# Altium schematic sheet 14-Counter74LS192.SchDoc
size A4
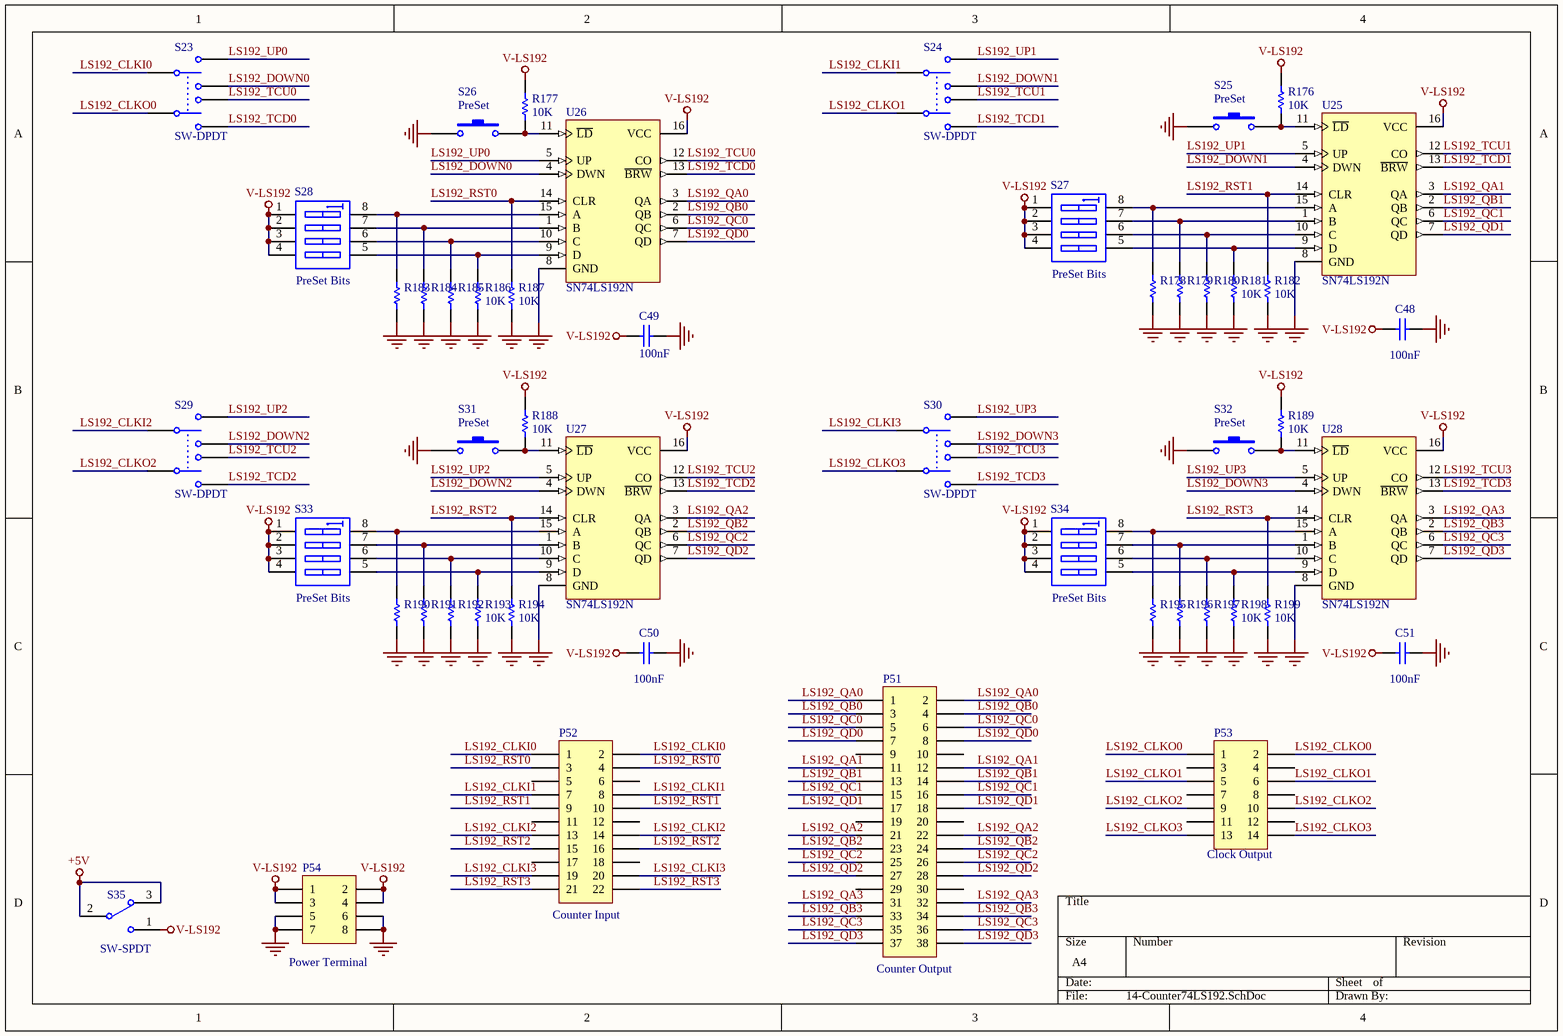
[diagram p0: 14-Counter74LS192.SchDoc]

## Parts
C48  value 100nF  [c-0805]  (hidden comment: 104)
C49  value 100nF  [c-0805]  (hidden comment: 104)
C50  value 100nF  [c-0805]  (hidden comment: 104)
C51  value 100nF  [c-0805]  (hidden comment: 104)
P51  value Counter Output  [HDR2X19]  (hidden comment: Header 19X2)
P52  value Counter Input  [HDR2X11]  (hidden comment: Header 11X2)
P53  value Clock Output  [HDR2X7]  (hidden comment: Header 7X2)
P54  Publisher: Power Terminal  [HDR2X4]  (hidden comment: Header 4X2)
R176  10K  [r-0805]
R177  10K  [r-0805]
R178  103  [r-0805]  (value not drawn)
R179  103  [r-0805]  (value not drawn)
R180  103  [r-0805]  (value not drawn)
R181  10K  [r-0805]
R182  10K  [r-0805]
R183  103  [r-0805]  (value not drawn)
R184  103  [r-0805]  (value not drawn)
R185  103  [r-0805]  (value not drawn)
R186  10K  [r-0805]
R187  10K  [r-0805]
R188  10K  [r-0805]
R189  10K  [r-0805]
R190  103  [r-0805]  (value not drawn)
R191  103  [r-0805]  (value not drawn)
R192  103  [r-0805]  (value not drawn)
R193  10K  [r-0805]
R194  10K  [r-0805]
R195  103  [r-0805]  (value not drawn)
R196  103  [r-0805]  (value not drawn)
R197  103  [r-0805]  (value not drawn)
R198  10K  [r-0805]
R199  10K  [r-0805]
S23  SW-DPDT  [DPDT-6]
S24  SW-DPDT  [DPDT-6]
S25  value PreSet  [SW2]  (hidden comment: SW-PB)
S26  value PreSet  [SW2]  (hidden comment: SW-PB)
S27  value PreSet Bits  [SW-DIP4]  (hidden comment: SW DIP-4)
S28  value PreSet Bits  [SW-DIP4]  (hidden comment: SW DIP-4)
S29  SW-DPDT  [DPDT-6]
S30  SW-DPDT  [DPDT-6]
S31  value PreSet  [SW2]  (hidden comment: SW-PB)
S32  value PreSet  [SW2]  (hidden comment: SW-PB)
S33  value PreSet Bits  [SW-DIP4]  (hidden comment: SW DIP-4)
S34  value PreSet Bits  [SW-DIP4]  (hidden comment: SW DIP-4)
S35  SW-SPDT  [SW-DIP1SMD]
U25  SN74LS192N  [DIP16]
U26  SN74LS192N  [DIP16]
U27  SN74LS192N  [DIP16]
U28  SN74LS192N  [DIP16]

## Nets
+5V: S35.2 S35.3
GND: C48.2 C49.2 C50.2 C51.2 P54.5 P54.6 P54.7 P54.8 R178.1 R179.1 R180.1 R181.1 R182.1 R183.1 R184.1 R185.1 R186.1 R187.1 R190.1 R191.1 R192.1 R193.1 R194.1 R195.1 R196.1 R197.1 R198.1 R199.1 S25.1 S26.1 S31.1 S32.1 U25.8(GND) U26.8(GND) U27.8(GND) U28.8(GND)
V-LS192: C48.1 C49.1 C50.1 C51.1 P54.1 P54.2 P54.3 P54.4 R176.2 R177.2 R188.2 R189.2 S27.1(A1) S27.2(A2) S27.3(A3) S27.4(A4) S28.1(A1) S28.2(A2) S28.3(A3) S28.4(A4) S33.1(A1) S33.2(A2) S33.3(A3) S33.4(A4) S34.1(A1) S34.2(A2) S34.3(A3) S34.4(A4) S35.1 U25.16(VCC) U26.16(VCC) U27.16(VCC) U28.16(VCC)
LS192_CLKI0: P52.1 P52.2 S23.1
LS192_CLKI1: P52.7 P52.8 S24.1
LS192_CLKI2: P52.13 P52.14 S29.1
LS192_CLKI3: P52.19 P52.20 S30.1
LS192_CLKO0: P53.1 P53.2 S23.4
LS192_CLKO1: P53.5 P53.6 S24.4
LS192_CLKO2: P53.9 P53.10 S29.4
LS192_CLKO3: P53.13 P53.14 S30.4
LS192_DOWN0: S23.3 U26.4(DWN)
LS192_DOWN1: S24.3 U25.4(DWN)
LS192_DOWN2: S29.3 U27.4(DWN)
LS192_DOWN3: S30.3 U28.4(DWN)
LS192_QA0: P51.1 P51.2 U26.3(QA)
LS192_QA1: P51.11 P51.12 U25.3(QA)
LS192_QA2: P51.21 P51.22 U27.3(QA)
LS192_QA3: P51.31 P51.32 U28.3(QA)
LS192_QB0: P51.3 P51.4 U26.2(QB)
LS192_QB1: P51.13 P51.14 U25.2(QB)
LS192_QB2: P51.23 P51.24 U27.2(QB)
LS192_QB3: P51.33 P51.34 U28.2(QB)
LS192_QC0: P51.5 P51.6 U26.6(QC)
LS192_QC1: P51.15 P51.16 U25.6(QC)
LS192_QC2: P51.25 P51.26 U27.6(QC)
LS192_QC3: P51.35 P51.36 U28.6(QC)
LS192_QD0: P51.7 P51.8 U26.7(QD)
LS192_QD1: P51.17 P51.18 U25.7(QD)
LS192_QD2: P51.27 P51.28 U27.7(QD)
LS192_QD3: P51.37 P51.38 U28.7(QD)
LS192_RST0: P52.3 P52.4 R187.2 U26.14(CLR)
LS192_RST1: P52.9 P52.10 R182.2 U25.14(CLR)
LS192_RST2: P52.15 P52.16 R194.2 U27.14(CLR)
LS192_RST3: P52.21 P52.22 R199.2 U28.14(CLR)
LS192_TCD0: S23.6 U26.13(~{BRW})
LS192_TCD1: S24.6 U25.13(~{BRW})
LS192_TCD2: S29.6 U27.13(~{BRW})
LS192_TCD3: S30.6 U28.13(~{BRW})
LS192_TCU0: S23.5 U26.12(CO)
LS192_TCU1: S24.5 U25.12(CO)
LS192_TCU2: S29.5 U27.12(CO)
LS192_TCU3: S30.5 U28.12(CO)
LS192_UP0: S23.2 U26.5(UP)
LS192_UP1: S24.2 U25.5(UP)
LS192_UP2: S29.2 U27.5(UP)
LS192_UP3: S30.2 U28.5(UP)
NetR176_1: R176.1 S25.2 U25.11(~{LD})
NetR177_1: R177.1 S26.2 U26.11(~{LD})
NetR178_2: R178.2 S27.8(B1) U25.15(A)
NetR179_2: R179.2 S27.7(B2) U25.1(B)
NetR180_2: R180.2 S27.6(B3) U25.10(C)
NetR181_2: R181.2 S27.5(B4) U25.9(D)
NetR183_2: R183.2 S28.8(B1) U26.15(A)
NetR184_2: R184.2 S28.7(B2) U26.1(B)
NetR185_2: R185.2 S28.6(B3) U26.10(C)
NetR186_2: R186.2 S28.5(B4) U26.9(D)
NetR188_1: R188.1 S31.2 U27.11(~{LD})
NetR189_1: R189.1 S32.2 U28.11(~{LD})
NetR190_2: R190.2 S33.8(B1) U27.15(A)
NetR191_2: R191.2 S33.7(B2) U27.1(B)
NetR192_2: R192.2 S33.6(B3) U27.10(C)
NetR193_2: R193.2 S33.5(B4) U27.9(D)
NetR195_2: R195.2 S34.8(B1) U28.15(A)
NetR196_2: R196.2 S34.7(B2) U28.1(B)
NetR197_2: R197.2 S34.6(B3) U28.10(C)
NetR198_2: R198.2 S34.5(B4) U28.9(D)

Not connected (* = marked no-connect by the designer): P51 9 10 19 20 29 30; P52 5 6 11 12 17 18; P53 3 4 7 8 11 12

## Library data of the parts
C48-C51 = Cap: Capacitor; Published: 8-Jun-2000; LatestRevisionDate: 17-Jul-2002; LatestRevisionNote: Re-released for DXP Platform.; PackageReference: RAD-0.3; Publisher: Altium Limited; PackageDescription: Radial Cap, Thru-Hole; 2 Leads; 0.3 in Pin Spacing
P51 = Header 19X2: Header, 19-Pin, Dual row; LatestRevisionDate: 17-Jul-2002; LatestRevisionNote: Re-released for DXP Platform.
P52 = Header 11X2: Header, 11-Pin, Dual row; LatestRevisionDate: 17-Jul-2002; LatestRevisionNote: Re-released for DXP Platform.
P53 = Header 7X2: Header, 7-Pin, Dual row; LatestRevisionDate: 17-Jul-2002; LatestRevisionNote: Re-released for DXP Platform.
P54 = Header 4X2: Header, 4-Pin, Dual row; LatestRevisionDate: 17-Jul-2002; LatestRevisionNote: Re-released for DXP Platform.
R176 R177 R181 R182 R186-R189 R193 R194 R198 R199 = Res1: Resistor; Published: 8-Jun-2000; LatestRevisionDate: 17-Jul-2002; LatestRevisionNote: Re-released for DXP Platform.; PackageReference: AXIAL-0.3; Publisher: Altium Limited; PackageDescription: Axial Device, Thru-Hole; 2 Leads; 0.3 in Pin Spacing; Value: 10K
R178-R180 R183-R185 R190-R192 R195-R197 = Res1: Resistor; Value: 10K; Published: 8-Jun-2000; LatestRevisionDate: 17-Jul-2002; LatestRevisionNote: Re-released for DXP Platform.; PackageReference: AXIAL-0.3; Publisher: Altium Limited; PackageDescription: Axial Device, Thru-Hole; 2 Leads; 0.3 in Pin Spacing
S23 S24 S29 S30 = SW-DPDT: Double-Pole, Double-Throw Switch; Published: 24-Mar-1999; LatestRevisionDate: 17-Jul-2002; LatestRevisionNote: Re-released for DXP Platform.; PackageReference: DPDT-6; Publisher: Altium Limited
S25 S26 S31 S32 = SW-PB: Switch; Published: 24-Mar-1999; LatestRevisionDate: 17-Jul-2002; LatestRevisionNote: Re-released for DXP Platform.; PackageReference: SPST-2
S27 S28 S33 S34 = SW DIP-4: DIP Switch, 4 Position, SPST; Published: 24-Mar-1999; LatestRevisionDate: 29-May-2009; LatestRevisionNote: IPC-7351 Footprint Added.; PackageVersion: Dec-2002; PackageReference: SO8; PackageDescription: 8-Pin Small Outline Integrated Circuit 1.27 mm Pitch; Code_JEDEC: MS-012-AA; Code_IPC: SOIC127P600-8
S35 = SW-SPDT: SPDT Subminiature Toggle Switch, Right Angle Mounting, Vertical Actuation; Published: 24-Mar-1999; LatestRevisionDate: 17-Dec-2003; LatestRevisionNote: Schematic revised, PCB Footprint replaced.; DatasheetVersion: 05-Dec-2000; PackageReference: TL36WW15050; Publisher: Altium Limited; PackageDescription: Switch; 4 Leads; ComponentLink1Description: Manufacturer Link; ComponentLink1URL: http://www.apem.com
U25-U28 = SN74LS192N: Synchronous 4-Bit Up/Down Counter (Dual Clock with Clear); ComponentAvailability: Obsolete; Published: 8-Jun-2000; LatestRevisionDate: 04-Mar-2005; LatestRevisionNote: Stylized 3D Model Added.; DatasheetVersion: Mar-1988; PackageVersion: Oct-1995; PackageReference: N016D; Publisher: Altium Limited; PackageDescription: DIP; 16 Leads; Row Spacing 7.62 mm; Pitch 2.54 mm; Code_JEDEC: MS-001-BB; ComponentLink1Description: Manufacturer Link; ComponentLink1URL: http://www.ti.com/; ComponentLink2Description: Datasheet; ComponentLink2URL: http://www-s.ti.com/sc/ds/sn74ls192.pdf